# EAGLE design bqcopter (EAGLE 6.1)
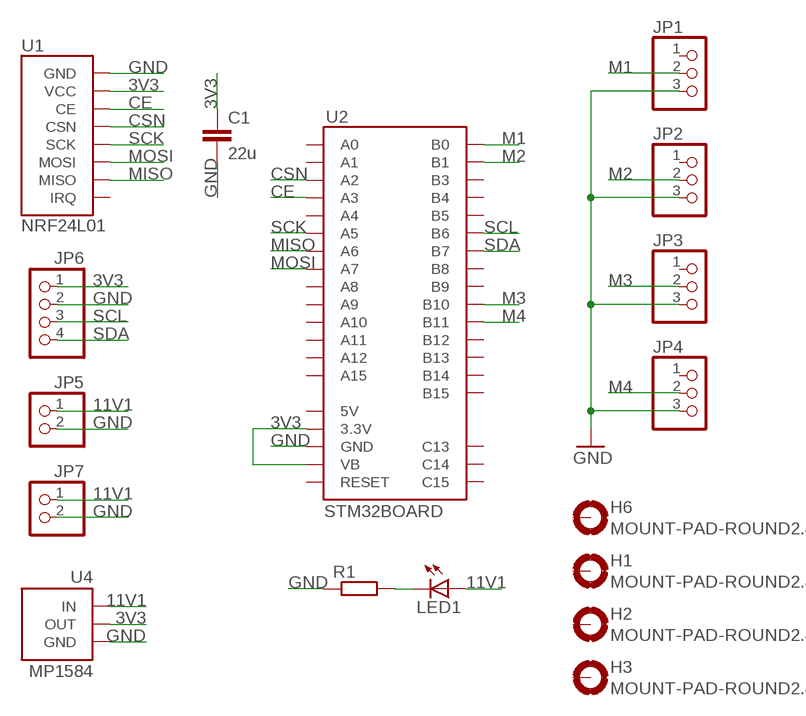
[diagram p0: schematic, sheet 1]

## Parts
C1  22u  C-EUC0805  [C0805]
H1  MOUNT-PAD-ROUND2.8  [2,8-PAD]
H2  MOUNT-PAD-ROUND2.8  [2,8-PAD]
H3  MOUNT-PAD-ROUND2.8  [2,8-PAD]
H6  MOUNT-PAD-ROUND2.8  [2,8-PAD]
JP1  PINHD-1X3  [1X03]
JP2  PINHD-1X3  [1X03]
JP3  PINHD-1X3  [1X03]
JP4  PINHD-1X3  [1X03]
JP5  PINHD-1X2  [1X02]
JP6  PINHD-1X4  [1X04]
JP7  PINHD-1X2  [1X02]
LED1  LED3MM  [LED3MM]
R1  R-EU_M0805  [M0805]
U1  NRF24L01  [NRF24L01]
U2  STM32BOARD  [STM32BOARD]
U4  MP1584  [MP1584]

## Nets
3V3: C1.1 JP6.1 U1.2(VCC) U2.3.3V_1(3.3V) U2.3.3V_2(3.3V) U2.VB U4.OUT+1(OUT) U4.OUT+2(OUT)
11V1: JP5.1 JP7.1 LED1.A U4.IN+1(IN) U4.IN+2(IN)
CE: U1.3(CE) U2.A3
CSN: U1.4(CSN) U2.A2
GND: C1.2 JP1.3 JP2.3 JP3.3 JP4.3 JP5.2 JP6.2 JP7.2 R1.1 U1.1(GND) U2.GND_1(GND) U2.GND_2(GND) U2.GND_3(GND) U4.IN-1(GND) U4.IN-2(GND) U4.OUT-1(GND) U4.OUT-2(GND)
M1: JP1.2 U2.B0
M2: JP2.2 U2.B1
M3: JP3.2 U2.B10
M4: JP4.2 U2.B11
MISO: U1.7(MISO) U2.A6
MOSI: U1.6(MOSI) U2.A7
N$1: LED1.K(C) R1.2
SCK: U1.5(SCK) U2.A5
SCL: JP6.3 U2.B6
SDA: JP6.4 U2.B7
Unconnected: H1.B2,8(MOUNT) H2.B2,8(MOUNT) H3.B2,8(MOUNT) H6.B2,8(MOUNT) JP1.1 JP2.1 JP3.1 JP4.1 U1.8(IRQ) U2.5V U2.A0 U2.A1 U2.A4 U2.A8 U2.A9 U2.A10 U2.A11 U2.A12 U2.A15 U2.B3 U2.B4 U2.B5 U2.B8 U2.B9 U2.B12 U2.B13 U2.B14 U2.B15 U2.C13 U2.C14 U2.C15 U2.RESET

## Library data of the parts
C1 = rcl:C-EU: CAPACITOR, European symbol
H1-H3 H6 = holes:MOUNT-PAD-ROUND: MOUNTING PAD, round
JP1-JP4 = pinhead:PINHD-1X3: PIN HEADER
JP5 JP7 = pinhead:PINHD-1X2: PIN HEADER
JP6 = pinhead:PINHD-1X4: PIN HEADER
LED1 = led:LED: LED OSRAM: - CHIPLED LG R971, LG N971, LY N971, LG Q971, LY Q971, LO R971, LY R971 LH N974, LH R974 LS Q976, LO Q976, LY Q976 LO Q996 - Hyper CHIPLED LW Q18S LB Q993, LB Q99A, LB R99A - SideLED LS A670, LO A670, LY A670, LG A670, LP A670 LB A673, LV A673, LT A673, LW A673 LH A674 LY A675 LS A676, LA A676, LO A676, LY A676, LW A676 LS A679, LY A679, LG A679 - Hyper Micro SIDELED® LS Y876, LA Y876, LO Y876, LY Y876 LT Y87S - SmartLED LW L88C, LW L88S LB L89C, LB L89S, LG L890 LS L89K, LO L89K, LY L89K LS L896, LA L896, LO L896, LY L896 - TOPLED LS T670, LO T670, LY T670, LG T670, LP T670 LSG T670, LSP T670, LSY T670, LOP T670, LYG T670 LG T671, LOG T671, LSG T671 LB T673, LV T673, LT T673, LW T673 LH T674 LS T676, LA T676, LO T676, LY T676, LB T676, LH T676, LSB T676, LW T676 LB T67C, LV T67C, LT T67C, LS T67K, LO T67K, LY T67K, LW E67C LS E67B, LA E67B, LO E67B, LY E67B, LB E67C, LV E67C, LT E67C LW T67C LS T679, LY T679, LG T679 LS T770, LO T770, LY T770, LG T770, LP T770 LB T773, LV T773, LT T773, LW T773 LH T774 LS E675, LA E675, LY E675, LS T675 LS T776, LA T776, LO T776, LY T776, LB T776 LHGB T686 LT T68C, LB T68C - Hyper Mini TOPLED® LB M676 - Mini TOPLED Santana® LG M470 LS M47K, LO M47K, LY M47K Source: http://www.osram.convergy.de LUXEON: - LUMILED® LXK2-PW12-R00, LXK2-PW12-S00, LXK2-PW14-U00, LXK2-PW14-V00 LXK2-PM12-R00, LXK2-PM12-S00, LXK2-PM14-U00 LXK2-PE12-Q00, LXK2-PE12-R00, LXK2-PE12-S00, LXK2-PE14-T00, LXK2-PE14-U00 LXK2-PB12-K00, LXK2-PB12-L00, LXK2-PB12-M00, LXK2-PB14-N00, LXK2-PB14-P00, LXK2-PB14-Q00 LXK2-PR12-L00, LXK2-PR12-M00, LXK2-PR14-Q00, LXK2-PR14-R00 LXK2-PD12-Q00, LXK2-PD12-R00, LXK2-PD12-S00 LXK2-PH12-R00, LXK2-PH12-S00 LXK2-PL12-P00, LXK2-PL12-Q00, LXK2-PL12-R00 Source: www.luxeon.com KINGBRIGHT: KA-3528ASYC Source: www.kingbright.com
R1 = rcl:R-EU_: RESISTOR, European symbol
U1 = RF:NRF24L01
U2 = boards:STM32BOARD
U4 = DCDC_converters:MP1584

## Board
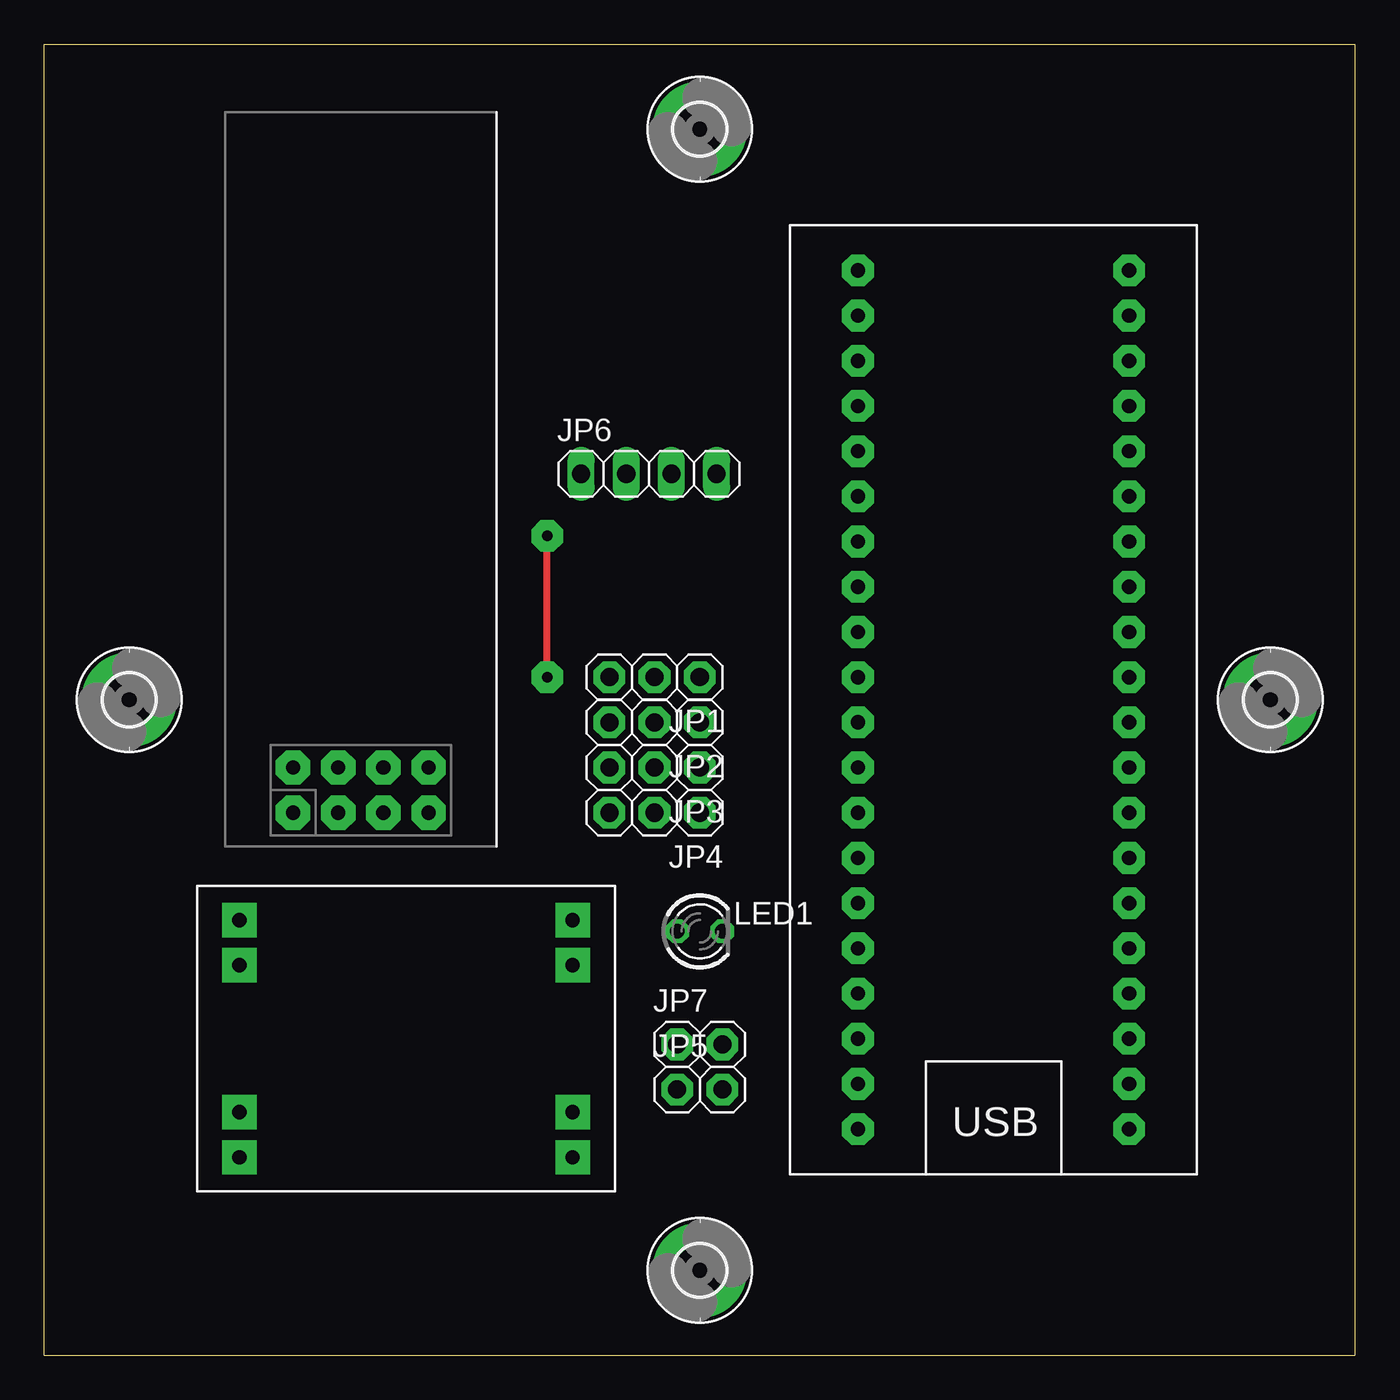
[diagram p1: board, top side]
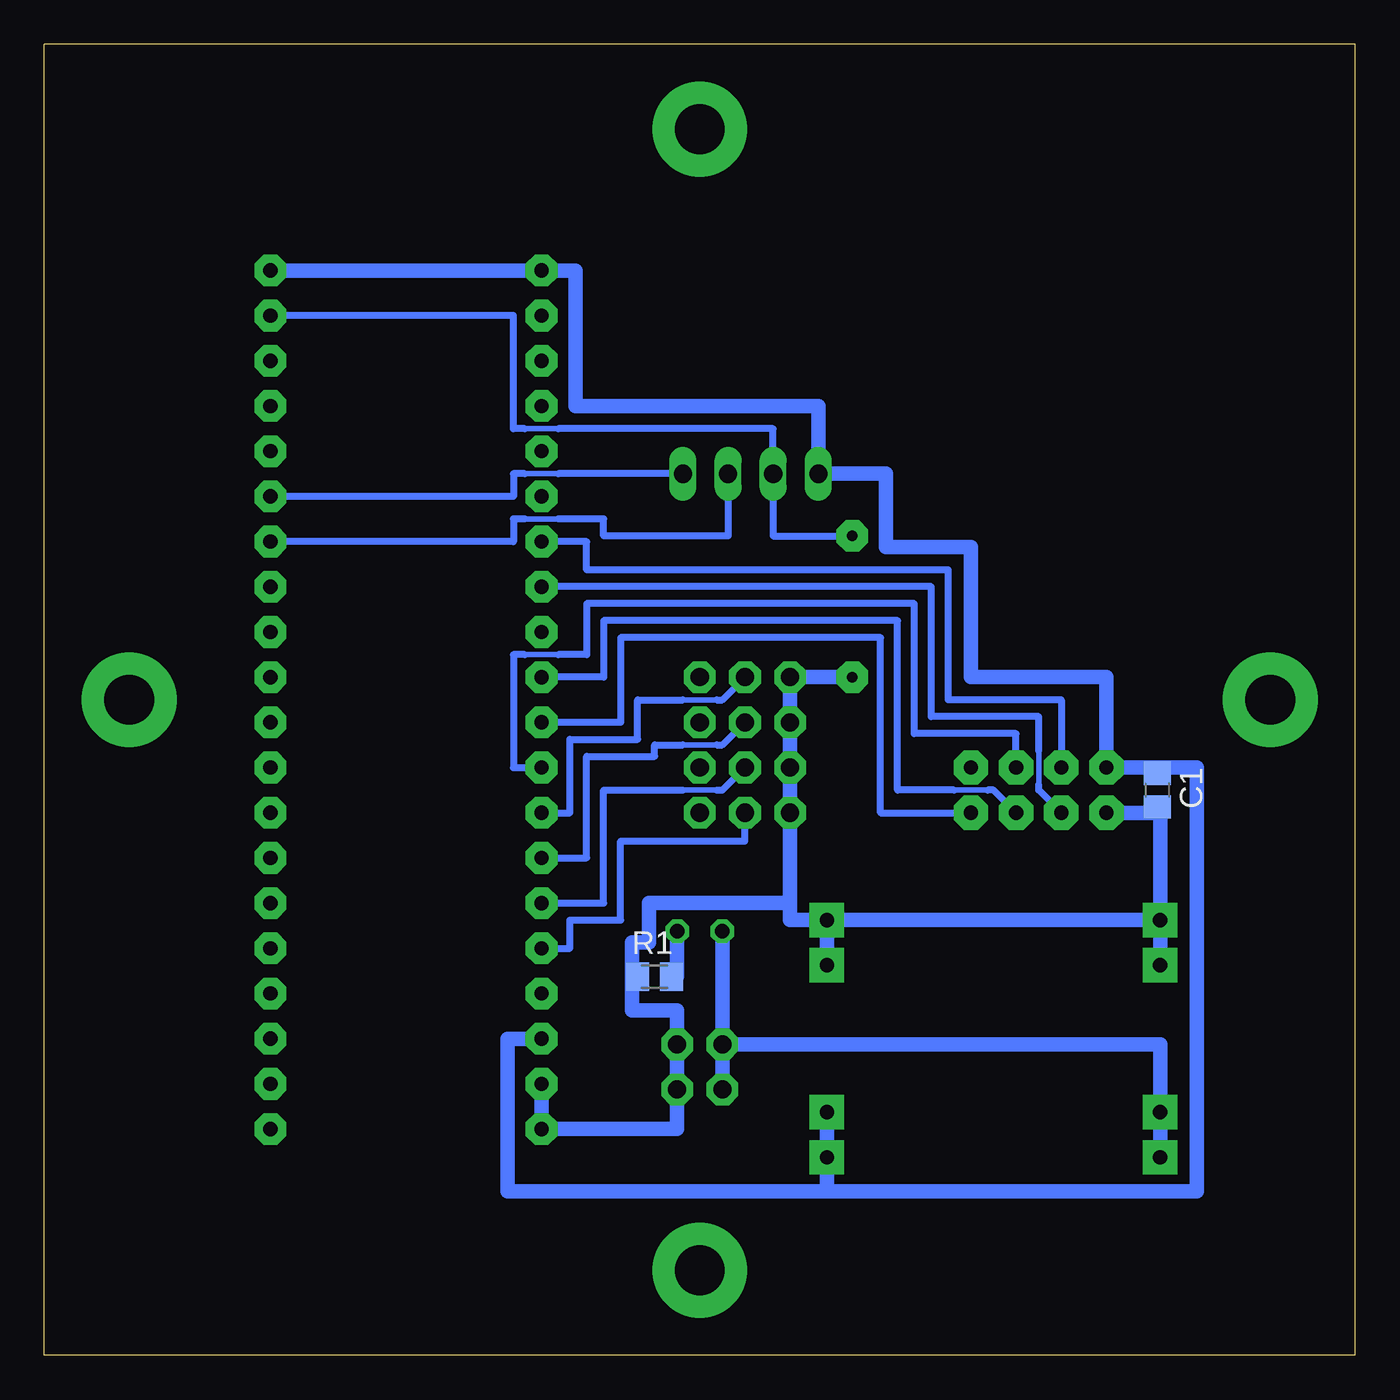
[diagram p2: board, bottom side, seen from below]

Size 73.66 x 73.66 mm. Coordinates in mm from the lower left corner, seen from the top.
Outline: 73.64,0 0,0 0,73.66 73.66,73.66 73.66,0
Copper layers (1*16): Top 0.035mm / dielectric 1.5mm / Bottom 0.035mm
Design rules: minimum track width 10mil, minimum drill 24mil, track to track 8mil, track to pad 8mil, pad to pad 8mil, via to via 8mil, smd to smd 8mil, copper to edge 40mil, drill to drill 8mil, minimum pad ring 10mil, minimum via ring 8mil, stop-mask expansion 4mil, vias tented up to drill 0mil, thermal gap 10mil

### Footprints (pad centres in the part's own frame; a part is rotated, then mirrored left to right if it is on the bottom)
C0805 = smd 1.3 x 1.5: 1 -0.95,0; 2 0.95,0
2,8-PAD = drill 2.8 pad 5.334: B2,8 0,0
1X03 = drill 1.016 pad 1.778 octagon: 1 -2.54,0; 2 0,0; 3 2.54,0
1X02 = drill 1.016 pad 1.778 octagon: 1 -1.27,0; 2 1.27,0
1X04 = drill 1.016 long: 1 -3.81,0; 2 -1.27,0; 3 1.27,0; 4 3.81,0
LED3MM = drill 0.813 octagon: A -1.27,0; K 1.27,0
M0805 = smd 1.3 x 1.6: 1 -0.95,0; 2 0.95,0
NRF24L01 = drill 0.8 pad 1.93 octagon: 1 19.05,-3.81; 2 16.51,-3.81; 3 19.05,-1.27; 4 16.51,-1.27; 5 19.05,1.27; 6 16.51,1.27; 7 19.05,3.81; 8 16.51,3.81
STM32BOARD = drill 0.8 pad 1.778 octagon: 3.3V_1 -7.62,-24.13; 3.3V_2 7.62,19.05; 5V -7.62,-19.05; A0 7.62,-13.97; A1 7.62,-11.43; A2 7.62,-8.89; A3 7.62,-6.35; A4 7.62,-3.81; A5 7.62,-1.27; A6 7.62,1.27; A7 7.62,3.81; A8 -7.62,13.97; A9 -7.62,11.43; A10 -7.62,8.89; A11 -7.62,6.35; A12 -7.62,3.81; A15 -7.62,1.27; B0 7.62,6.35; B1 7.62,8.89; B3 -7.62,-1.27; B4 -7.62,-3.81; B5 -7.62,-6.35; B6 -7.62,-8.89; B7 -7.62,-11.43; B8 -7.62,-13.97; B9 -7.62,-16.51; B10 7.62,11.43; B11 7.62,13.97; B12 -7.62,24.13; B13 -7.62,21.59; B14 -7.62,19.05; B15 -7.62,16.51; C13 7.62,-21.59; C14 7.62,-19.05; C15 7.62,-16.51; GND_1 -7.62,-21.59; GND_2 7.62,24.13; GND_3 7.62,21.59; RESET 7.62,16.51; VB 7.62,-24.13
MP1584 = drill 0.8 pad 1.93 square: IN+1 -9.366,-4.128; IN+2 -9.366,-6.668; IN-1 -9.366,6.668; IN-2 -9.366,4.128; OUT+1 9.366,-4.128; OUT+2 9.366,-6.668; OUT-1 9.366,6.668; OUT-2 9.366,4.128

### Placement (x,y rotation side)
C1  11.11,31.75 270 bottom
H1  4.76,36.83 0 top
H2  36.83,68.9 0 top
H3  68.9,36.83 0 top
H6  36.83,4.76 0 top
JP1  34.29,38.1 180 top
JP2  34.29,35.56 180 top
JP3  34.29,33.02 180 top
JP4  34.29,30.48 180 top
JP5  36.83,14.92 0 top
JP6  33.97,49.53 0 top
JP7  36.83,17.46 0 top
LED1  36.83,23.81 0 top
R1  39.37,21.27 0 bottom
U1  17.78,49.53 270 top
U2  53.34,36.83 180 top
U4  20.32,17.78 0 top

### Tracks (layer width: path | path; a pad name or v marks a point on that pad's centre or on a via)
3V3
  Bottom 0.813: 29.69,9.21 8.89,9.21 8.89,33.02 11.11,33.02 | U2.3.3V_1 U2.VB 43.81,60.96 43.81,53.34 30.16,53.34 JP6.1 26.35,49.53 26.35,45.4 21.59,45.4 21.59,38.1 13.97,38.1 U1.2 11.11,33.02 | U2.3.3V_2 47.62,17.78 47.62,9.21 29.69,9.21 | 29.69,9.21 U4.OUT+2 U4.OUT+1 | C1.1 11.11,33.02
11V1
  Bottom 0.813: JP7.1 JP5.1 | U4.IN+2 U4.IN+1 10.95,17.46 JP7.1 | LED1.A JP7.1
CE
  Bottom 0.305: 17.78,32.07 17.78,33.97
  Bottom 0.406: 17.78,32.07 17.78,31.75 U1.3 | 17.78,33.97 17.78,35.88 23.81,35.88 23.81,43.18 U2.A3
CSN
  Bottom 0.406: U2.A2 43.18,45.72 43.18,44.13 22.86,44.13 22.86,36.83 16.51,36.83 U1.4
GND  (via drill 0.6 pad 1.78)
  Top 0.406: v28.26,38.1 v28.26,46.04
  Bottom 0.305: 44.77,52.07 46.67,52.07
  Bottom 0.406: 10.95,30.48 11.43,30.48 C1.2 | v28.26,46.04 32.7,46.04 JP6.2 32.7,52.07 44.77,52.07 | 46.67,52.07 47.31,52.07 47.31,58.42 U2.GND_1
  Bottom 0.813: U4.IN-2 U4.IN-1 | U4.OUT-2 U4.OUT-1 | U4.OUT-1 U4.IN-1 | U4.OUT-1 31.75,24.45 31.75,25.4 | 31.75,25.4 JP4.3 JP3.3 JP2.3 JP1.3 v28.26,38.1 | U2.GND_3 U2.GND_2 38.1,12.7 JP5.2 JP7.2 38.1,19.37 40.64,19.37 40.64,20.64 | 40.64,20.64 40.64,23.18 39.69,23.18 39.69,25.4 31.75,25.4 | R1.1 40.64,20.64 | 11.43,30.48 U1.1 | 10.95,30.48 U4.IN-1
M1
  Bottom 0.305: 37.78,36.83 35.88,36.83
  Bottom 0.406: U2.B0 44.13,30.48 44.13,34.61 40.32,34.61 40.32,36.83 37.78,36.83 | 35.88,36.83 35.56,36.83 JP1.2
M2
  Bottom 0.305: 37.78,34.29 35.88,34.29
  Bottom 0.406: U2.B1 43.18,27.94 43.18,33.66 39.37,33.66 39.37,34.29 37.78,34.29 | 35.88,34.29 35.56,34.29 JP2.2
M3
  Bottom 0.305: 37.78,31.75 35.88,31.75
  Bottom 0.406: U2.B10 42.23,25.4 42.23,31.75 37.78,31.75 | 35.88,31.75 35.56,31.75 JP3.2
M4
  Bottom 0.406: U2.B11 44.13,22.86 44.13,24.45 41.27,24.45 41.27,28.89 34.29,28.89 JP4.2
MISO
  Bottom 0.406: U2.A6 41.27,35.56 41.27,40.32 26.67,40.32 26.67,30.48 U1.7
MOSI
  Bottom 0.305: 44.77,39.37 46.67,39.37
  Bottom 0.406: 44.77,39.37 43.18,39.37 43.18,42.23 24.77,42.23 24.77,34.92 19.05,34.92 U1.6 | 46.67,39.37 47.31,39.37 47.31,33.02 U2.A7
N$1
  Bottom 0.813: R1.2 38.1,21.27 LED1.K
SCK
  Bottom 0.305: 20.64,31.75 22.54,31.75
  Bottom 0.406: 20.64,31.75 20.32,31.75 U1.5 | 22.54,31.75 25.72,31.75 25.72,41.27 42.23,41.27 42.23,38.1 U2.A5
SCL
  Bottom 0.305: 44.77,46.99 46.67,46.99
  Bottom 0.406: U2.B6 47.31,45.72 47.31,46.99 46.67,46.99 | JP6.3 35.24,46.04 42.23,46.04 42.23,46.99 44.77,46.99
SDA
  Bottom 0.305: 44.77,49.53 46.67,49.53
  Bottom 0.406: JP6.4 44.77,49.53 | 46.67,49.53 47.31,49.53 47.31,48.26 U2.B7